# Altium schematic sheet MCU.SchDoc
size A4
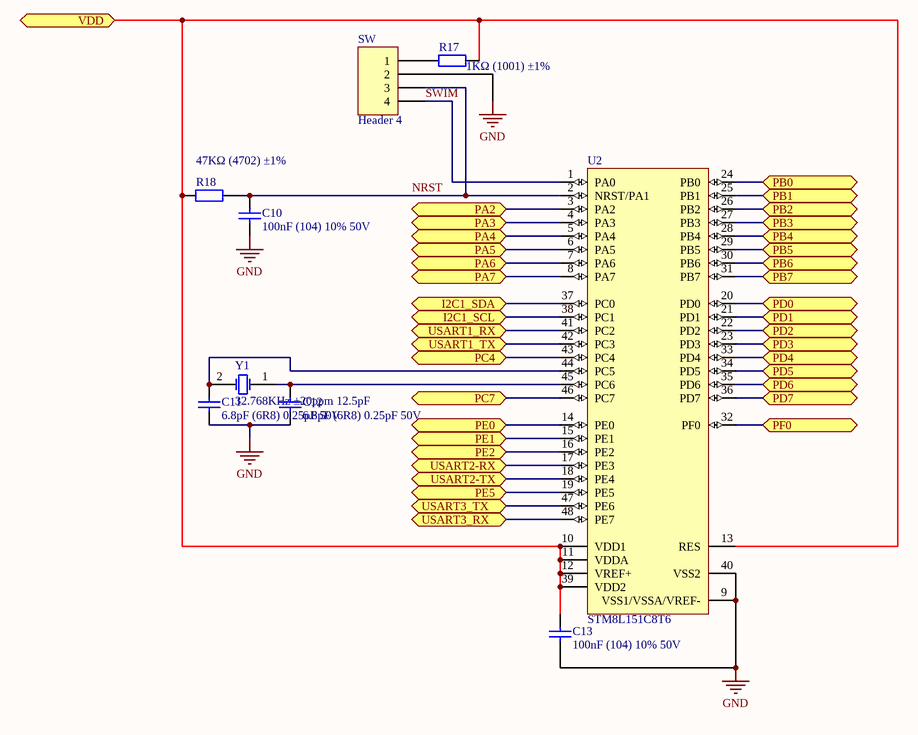
[diagram p0: MCU.SchDoc]

## Parts
C10  100nF (104) 10% 50V  [0603_C]
C11  6.8pF (6R8) 0.25pF 50V  [0603_C]
C12  6.8pF (6R8) 0.25pF 50V  [0603_C]
C13  100nF (104) 10% 50V  [0603_C]
R17  1KΩ (1001) ±1%  [0603_R]
R18  47KΩ (4702) ±1%  [0603_R]
SW  Header 4  [HDR1X4]
U2  STM8L151C8T6  [LQFP48_M]
Y1  32.768KHz ±20ppm 12.5pF  [SMD-3215_2P FC - 135]

## Ports
I2C1_SCL (bidir), I2C1_SDA (bidir), PA2 (bidir), PA3 (bidir), PA4 (bidir), PA5 (bidir), PA6 (bidir), PA7 (bidir), PB0 (bidir), PB1 (bidir), PB2 (bidir), PB3 (bidir), PB4 (bidir), PB5 (bidir), PB6 (bidir), PB7 (bidir), PC4 (bidir), PC7 (bidir), PD0 (bidir), PD1 (bidir), PD2 (bidir), PD3 (bidir), PD4 (bidir), PD5 (bidir), PD6 (bidir), PD7 (bidir), PE0 (bidir), PE1 (bidir), PE2 (bidir), PE5 (bidir), PF0 (bidir), USART1_RX (bidir), USART1_TX (bidir), USART2-RX (bidir), USART2-TX (bidir), USART3_RX (bidir), USART3_TX (bidir), VDD

## Nets
GND: C10.1 C11.1 C12.1 C13.1 SW.2 U2.9(VSS1/VSSA/VREF-) U2.40(VSS2)
I2C1_SCL: U2.38(PC1) ; port I2C1_SCL
I2C1_SDA: U2.37(PC0) ; port I2C1_SDA
NRST: C10.2 R18.1 SW.3 U2.2(NRST/PA1)
PA2: U2.3(PA2) ; port PA2
PA3: U2.4(PA3) ; port PA3
PA4: U2.5(PA4) ; port PA4
PA5: U2.6(PA5) ; port PA5
PA6: U2.7(PA6) ; port PA6
PA7: U2.8(PA7) ; port PA7
PB0: U2.24(PB0) ; port PB0
PB1: U2.25(PB1) ; port PB1
PB2: U2.26(PB2) ; port PB2
PB3: U2.27(PB3) ; port PB3
PB4: U2.28(PB4) ; port PB4
PB5: U2.29(PB5) ; port PB5
PB6: U2.30(PB6) ; port PB6
PB7: U2.31(PB7) ; port PB7
PC4: U2.43(PC4) ; port PC4
PC7: U2.46(PC7) ; port PC7
PD0: U2.20(PD0) ; port PD0
PD1: U2.21(PD1) ; port PD1
PD2: U2.22(PD2) ; port PD2
PD3: U2.23(PD3) ; port PD3
PD4: U2.33(PD4) ; port PD4
PD5: U2.34(PD5) ; port PD5
PD6: U2.35(PD6) ; port PD6
PD7: U2.36(PD7) ; port PD7
PE0: U2.14(PE0) ; port PE0
PE1: U2.15(PE1) ; port PE1
PE2: U2.16(PE2) ; port PE2
PE5: U2.19(PE5) ; port PE5
PF0: U2.32(PF0) ; port PF0
SWIM: SW.4 U2.1(PA0)
USART1_RX: U2.41(PC2) ; port USART1_RX
USART1_TX: U2.42(PC3) ; port USART1_TX
USART2-RX: U2.17(PE3) ; port USART2-RX
USART2-TX: U2.18(PE4) ; port USART2-TX
USART3_RX: U2.48(PE7) ; port USART3_RX
USART3_TX: U2.47(PE6) ; port USART3_TX
VDD: C13.2 R17.2 R18.2 U2.10(VDD1) U2.11(VDDA) U2.12(VREF+) U2.13(RES) U2.39(VDD2) ; port VDD
NetC11_2: C11.2 U2.44(PC5) Y1.2(OSC2)
NetC12_2: C12.2 U2.45(PC6) Y1.1(OSC1)
NetR17_1: R17.1 SW.1

## Library data of the parts
C10 C13 = 0603 100nF (104) 10% 50V: 贴片电容; ComponentLink1Description: 供应商链接; ComponentLink1URL: http://www.szlcsc.com/product/details_15331.html; Package: 0603; Supplier: LC; SuppliersPartNumber: C14663
C11 C12 = 0603 6.8pF (6R8) 0.25pF 50V: 贴片电容; ComponentLink1Description: 供应商链接; ComponentLink1URL: http://www.szlcsc.com/product/details_2031.html; Package: 0603; Supplier: LC; SuppliersPartNumber: C1679
R17 = 0603 1KΩ (1001) 1%: 贴片电阻; ComponentLink1Description: 供应商链接; ComponentLink1URL: http://www.szlcsc.com/product/details_21904.html; Package: 0603; Supplier: LC; SuppliersPartNumber: C21190
R18 = 0603 100KΩ (1003) 1%: 贴片电阻; ComponentLink1Description: 供应商链接; ComponentLink1URL: http://www.szlcsc.com/product/details_26546.html; Package: 0603; Supplier: LC; SuppliersPartNumber: C25803
SW = Header 4: Header, 4-Pin; LatestRevisionDate: 17-Jul-2002; LatestRevisionNote: Re-released for DXP Platform.; Publisher: Altium Limited
U2 = STM8L151C8T6: STM8L ARM-based EnergyLite 8-bit MCU, 64 kB Flash, 4 kB Internal RAM, -40 to +85°C Temperature, 48-pin LQFP, Tray; PackageVersion: rev13, Apr-2011; PackageReference: LQFP48; PackageDescription: 48-Pin Low-Profile Quad Flat Pack, 7 x 7 mm Body, 0.5 mm Pitch (LQFP48); ComponentLink1Description: Manufacturer URL; ComponentLink1URL: http://www.st.com/; ComponentLink2Description: STM8L151/152,x8,R6 Datasheet; ComponentLink2URL: http://www.st.com/internet/com/TECHNICAL_RESOURCES/TECHNICAL_LITERATURE/DATASHEET/CD00284933.pdf; ComponentLink3Description: STM8L Family Web Page; ComponentLink3URL: http://www.st.com/internet/mcu/subclass/1381.jsp
Y1 = SMD-3215_2P 32.768KHz 20ppm 12.5pF: 贴片晶振; ComponentLink1Description: 供应商链接; ComponentLink1URL: http://www.szlcsc.com/product/details_33310.html; Package: SMD-3215_2P; Supplier: LC; SuppliersPartNumber: C32346